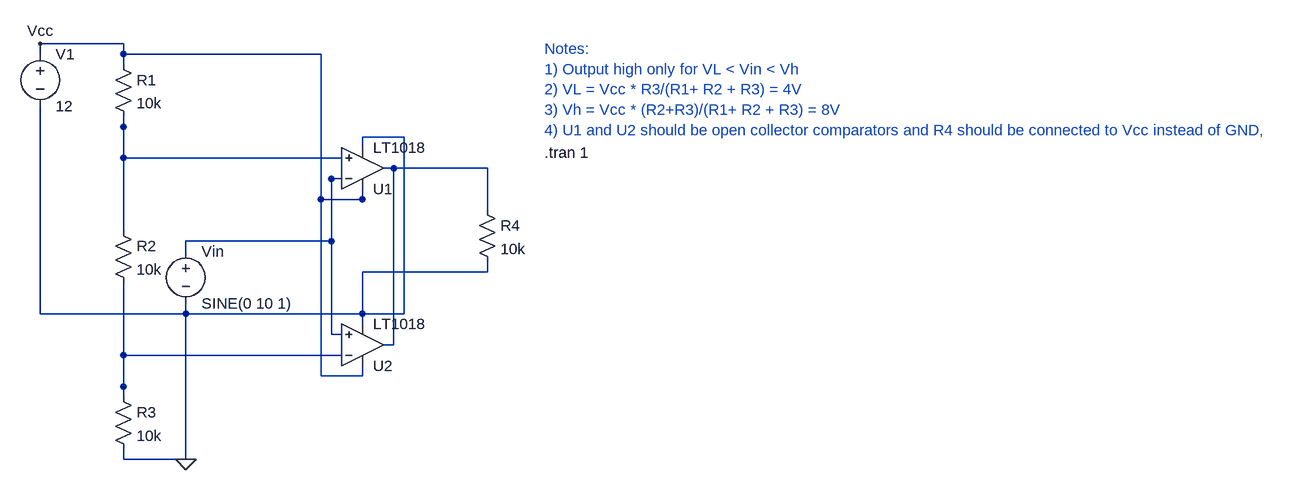
[diagram p0: schematic Window-comparator.asc]
Window-comparator.asc, the LTspice schematic file:
Version 4.1
SHEET 1 2144 692
WIRE 320 608 320 624
WIRE 880 320 880 336
WIRE 688 144 688 128
WIRE 688 416 688 400
WIRE 192 80 192 96
WIRE 416 384 416 400
WIRE 320 624 416 624
WIRE 416 624 416 400
WIRE 416 400 688 400
WIRE 688 400 688 336
WIRE 688 336 880 336
WIRE 688 400 752 400
WIRE 752 400 752 128
WIRE 752 128 688 128
WIRE 416 400 192 400
WIRE 192 400 192 96
FLAG 416 624 0
WIRE 320 96 320 112
WIRE 320 272 320 256
WIRE 656 160 640 160
WIRE 320 112 320 256
WIRE 320 112 320 160
WIRE 320 160 640 160
WIRE 880 240 880 224
WIRE 720 176 736 176
WIRE 720 448 736 448
WIRE 880 224 880 176
WIRE 880 176 736 176
WIRE 736 176 736 448
WIRE 656 192 640 192
WIRE 656 432 640 432
WIRE 416 304 416 288
WIRE 640 192 640 432
WIRE 640 192 640 288
WIRE 640 288 416 288
WIRE 320 352 320 368
WIRE 320 528 320 512
WIRE 656 464 640 464
WIRE 320 368 320 512
WIRE 320 512 320 464
WIRE 320 464 640 464
WIRE 320 16 320 0
WIRE 688 208 688 224
WIRE 688 480 688 496
WIRE 192 0 192 -16
WIRE 320 0 320 -16
WIRE 320 -16 192 -16
WIRE 320 0 624 0
WIRE 624 0 624 224
WIRE 624 224 688 224
WIRE 688 224 624 224
WIRE 624 224 624 496
WIRE 624 496 688 496
FLAG 192 -16 Vcc
SYMBOL voltage 192 -16 R0
WINDOW 123 0 0 Left 0
WINDOW 39 0 0 Left 0
SYMATTR InstName V1
SYMATTR Value 12
SYMBOL voltage 416 288 R0
WINDOW 123 0 0 Left 0
WINDOW 39 0 0 Left 0
SYMATTR InstName Vin
SYMATTR Value SINE(0 10 1)
SYMBOL Comparators\\LT1018 688 448 M180
SYMATTR InstName U2
SYMBOL res 304 0 R0
SYMATTR InstName R1
SYMATTR Value 10k
SYMBOL res 304 256 R0
SYMATTR InstName R2
SYMATTR Value 10k
SYMBOL res 304 512 R0
SYMATTR InstName R3
SYMATTR Value 10k
SYMBOL res 864 224 R0
SYMATTR InstName R4
SYMATTR Value 10k
SYMBOL Comparators\\LT1018 688 176 M180
SYMATTR InstName U1
TEXT 968 152 Left 2 !.tran 1
TEXT 968 -8 Left 2 ;Notes:\n1) Output high only for VL < Vin < Vh\n2) VL = Vcc * R3/(R1+ R2 + R3) = 4V\n3) Vh = Vcc * (R2+R3)/(R1+ R2 + R3) = 8V\n4) U1 and U2 should be open collector comparators and R4 should be connected to Vcc instead of GND,

The netlist it stands for:
* Window-comparator.asc
V1 Vcc 0 12
Vin N003 0 SINE(0 10 1)
X§U2 N003 N004 Vcc 0 N002 LT1018  ; pins In+ In- V+ V- OUT
R1 Vcc N001 10k
R2 N001 N004 10k
R3 N004 0 10k
R4 N002 0 10k
X§U1 N001 N003 Vcc 0 N002 LT1018  ; pins In+ In- V+ V- OUT
.tran 1
* Notes:
* 1) Output high only for VL < Vin < Vh
* 2) VL = Vcc * R3/(R1+ R2 + R3) = 4V
* 3) Vh = Vcc * (R2+R3)/(R1+ R2 + R3) = 8V
* 4) U1 and U2 should be open collector comparators and R4 should be connected to Vcc instead of GND,
.lib LTC1.lib
.backanno
.end